# EAGLE design Transmitter Circuit v2.0 (EAGLE 4.16)
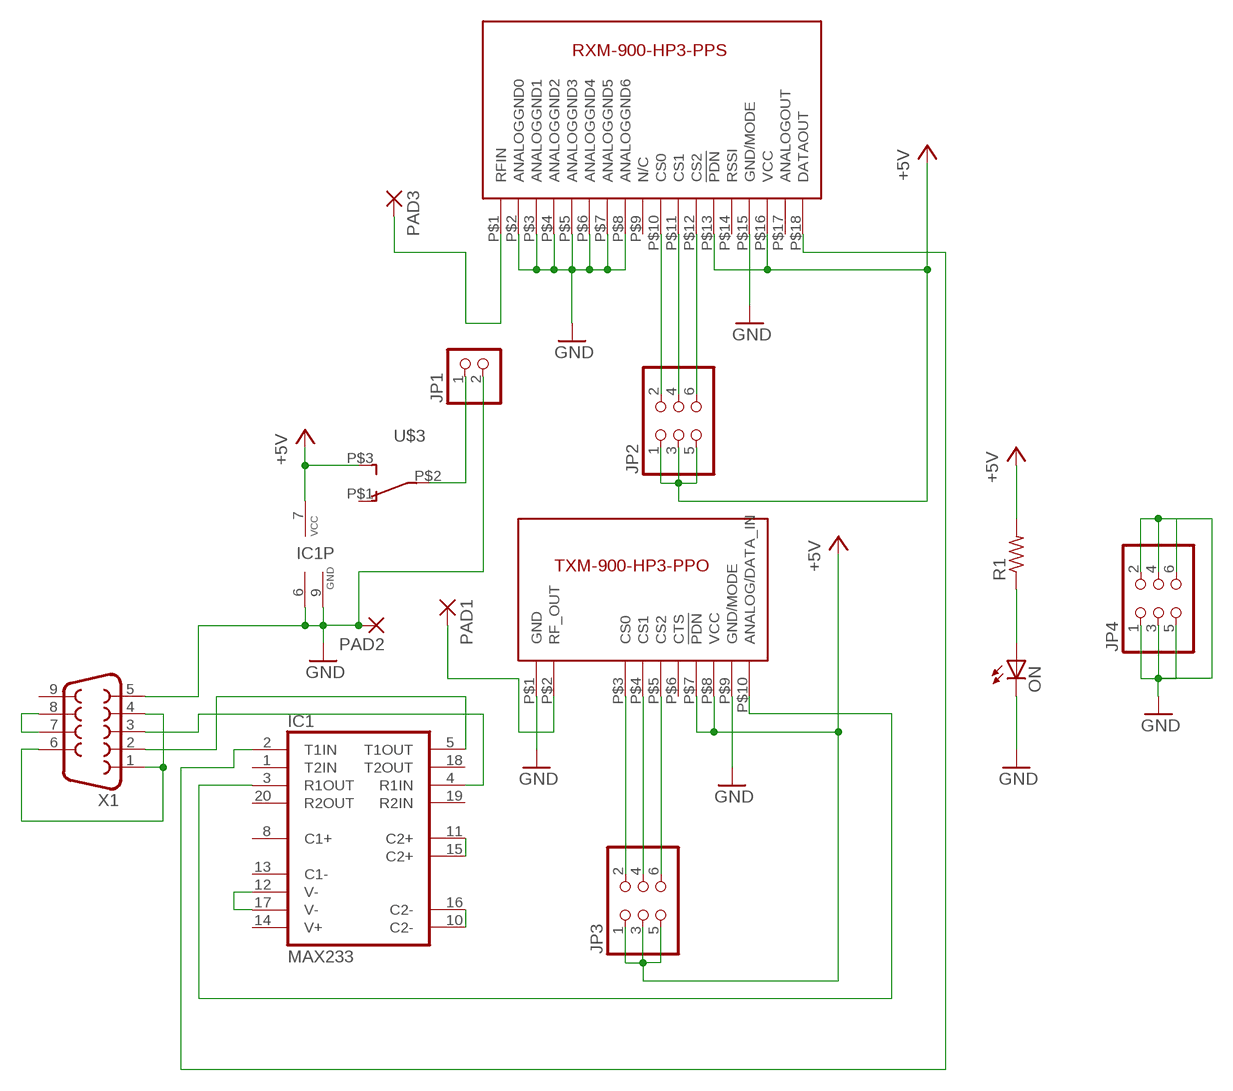
[diagram p0: schematic, sheet 1]

## Parts
IC1  MAX233  [DIL20]
JP1  PINHD-1X2  [1X02]
JP2  PINHD-2X3  [2X03]
JP3  PINHD-2X3  [2X03]
JP4  PINHD-2X3  [2X03]
ON  LED5MM  [LED5MM]
PAD1  2,54/0,8  [2,54/0,8]
PAD2  2,54/0,8  [2,54/0,8]
PAD3  2,54/0,8  [2,54/0,8]
R1  R-US_R1206  [R1206]
U$1  TXM-900-HP3-PPO  [SIP-10]
U$2  RX  [RX_UPRIGHT]
U$3  SLIDESWITCH  [SLIDESWITCH]
X1  F09D  [F09D]

## Nets
+5V [supply]: IC1.7(VCC) JP2.1 JP2.3 JP2.5 JP3.1 JP3.3 JP3.5 R1.2 U$1.P$7(!PDN) U$1.P$8(VCC) U$2.P$13(!PDN) U$2.P$16(VCC) U$3.P$3(S)
GND [supply]: IC1.6(GND) IC1.9(GND) JP1.2 JP4.1 JP4.2 JP4.3 JP4.4 JP4.5 JP4.6 ON.K(C) PAD2.1(P) U$1.P$1(GND) U$1.P$9(GND/MODE) U$2.P$2(ANALOGGND0) U$2.P$3(ANALOGGND1) U$2.P$4(ANALOGGND2) U$2.P$5(ANALOGGND3) U$2.P$6(ANALOGGND4) U$2.P$7(ANALOGGND5) U$2.P$8(ANALOGGND6) U$2.P$15(GND/MODE) X1.5
N$1: JP3.2 U$1.P$3(CS0)
N$2: JP3.4 U$1.P$4(CS1)
N$3: JP3.6 U$1.P$5(CS2)
N$4: IC1.4(R1IN) X1.3
N$5: X1.7 X1.8
N$6: IC1.12(V-) IC1.17(V-)
N$7: X1.1 X1.4 X1.6
N$8: IC1.10(C2-) IC1.16(C2-)
N$9: IC1.5(T1OUT) X1.2
N$10: IC1.11(C2+) IC1.15(C2+)
N$11: IC1.3(R1OUT) U$1.P$10(ANALOG/DATA_IN)
N$12: PAD1.1(P) U$1.P$2(RF_OUT)
N$13: ON.A R1.1
N$14: PAD3.1(P) U$2.P$1(RFIN)
N$15 [supply]: JP1.1 U$3.P$2(P)
N$16: JP2.2 U$2.P$10(CS0)
N$17: JP2.4 U$2.P$11(CS1)
N$18: JP2.6 U$2.P$12(CS2)
N$21: IC1.2(T1IN) U$2.P$18(DATAOUT)
Unconnected: IC1.1(T2IN) IC1.8(C1+) IC1.13(C1-) IC1.14(V+) IC1.18(T2OUT) IC1.19(R2IN) IC1.20(R2OUT) U$1.P$6(CTS) U$2.P$9(N/C) U$2.P$14(RSSI) U$2.P$17(ANALOGOUT) U$3.P$1(O) X1.9

## Library data of the parts
IC1 = maxim:MAX233: RS232 TRANSEIVER
JP1 = pinhead:PINHD-1X2: PIN HEADER
JP2-JP4 = pinhead:PINHD-2X3: PIN HEADER
ON = led:LED: LED OSRAM: - CHIPLED LG R971, LG N971, LY N971, LG Q971, LY Q971, LO R971, LY R971 LH N974, LH R974 LS Q976, LO Q976, LY Q976 LO Q996 - Hyper CHIPLED LW Q18S LB Q993, LB Q99A, LB R99A - SideLED LS A670, LO A670, LY A670, LG A670, LP A670 LB A673, LV A673, LT A673, LW A673 LH A674 LY A675 LS A676, LA A676, LO A676, LY A676, LW A676 LS A679, LY A679, LG A679 - Hyper Micro SIDELED® LS Y876, LA Y876, LO Y876, LY Y876 LT Y87S - SmartLED LW L88C, LW L88S LB L89C, LB L89S, LG L890 LS L89K, LO L89K, LY L89K LS L896, LA L896, LO L896, LY L896 - TOPLED LS T670, LO T670, LY T670, LG T670, LP T670 LSG T670, LSP T670, LSY T670, LOP T670, LYG T670 LG T671, LOG T671, LSG T671 LB T673, LV T673, LT T673, LW T673 LH T674 LS T676, LA T676, LO T676, LY T676, LB T676, LH T676, LSB T676, LW T676 LB T67C, LV T67C, LT T67C, LS T67K, LO T67K, LY T67K, LW E67C LS E67B, LA E67B, LO E67B, LY E67B, LB E67C, LV E67C, LT E67C LW T67C LS T679, LY T679, LG T679 LS T770, LO T770, LY T770, LG T770, LP T770 LB T773, LV T773, LT T773, LW T773 LH T774 LS E675, LA E675, LY E675, LS T675 LS T776, LA T776, LO T776, LY T776, LB T776 LHGB T686 LT T68C, LB T68C - Hyper Mini TOPLED® LB M676 - Mini TOPLED Santana® LG M470 LS M47K, LO M47K, LY M47K Source: http://www.osram.convergy.de/
PAD1-PAD3 = wirepad:2,54/0,8: THROUGH-HOLE PAD
R1 = rcl:R-US_: RESISTOR, American symbol
U$1 = linxtechnologies:TXM-900-HP3-PPO
U$2 = linxtechnologies:RX
U$3 = RFClib:SLIDESWITCH
X1 = con-subd:F09: SUB-D

## Net classes
1 supply: width 0.508 mm

## Board
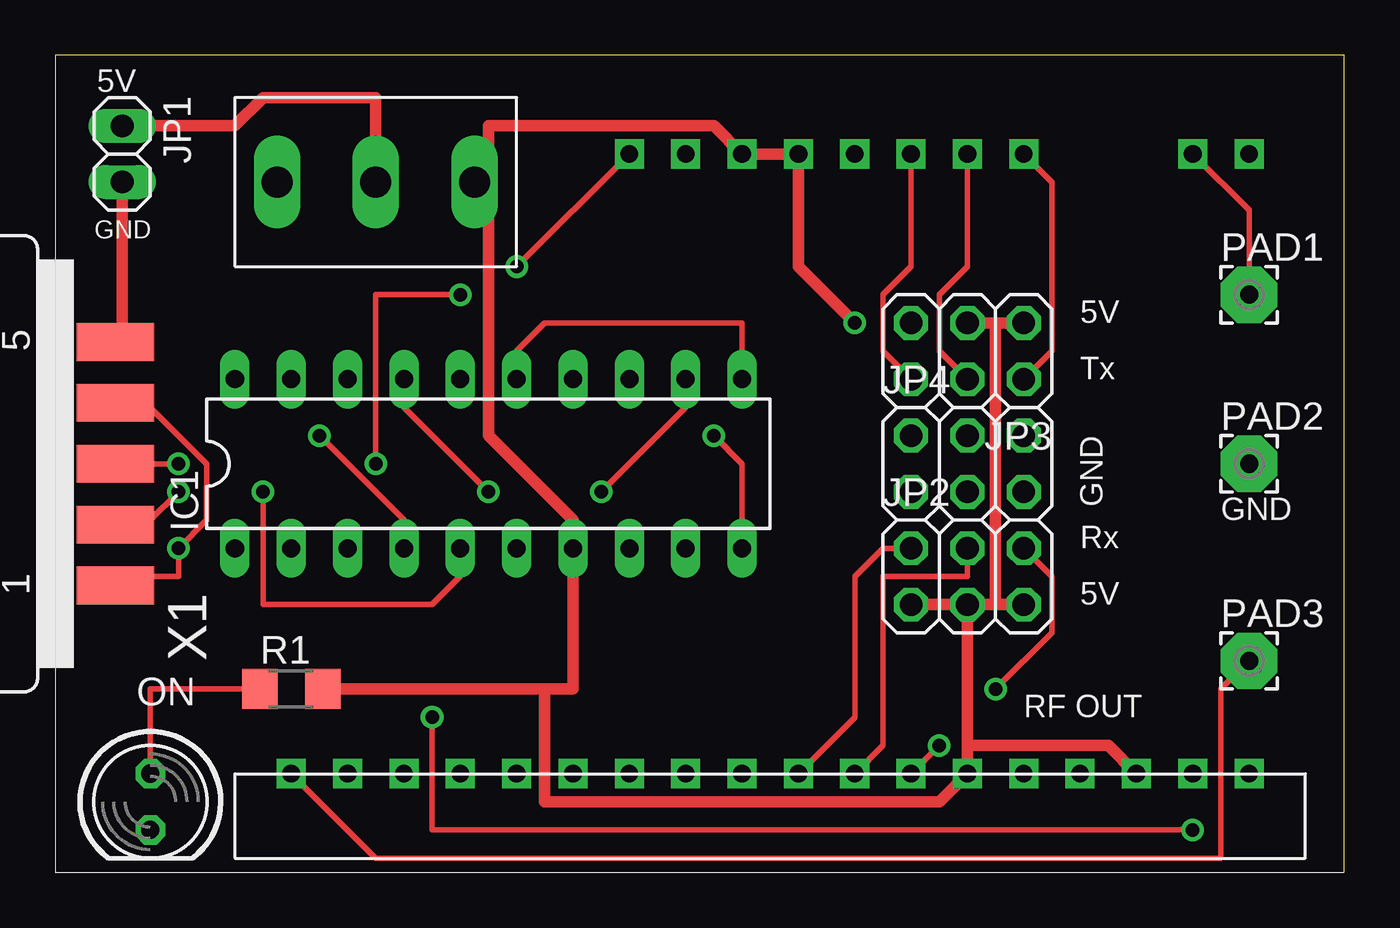
[diagram p1: board, top side]
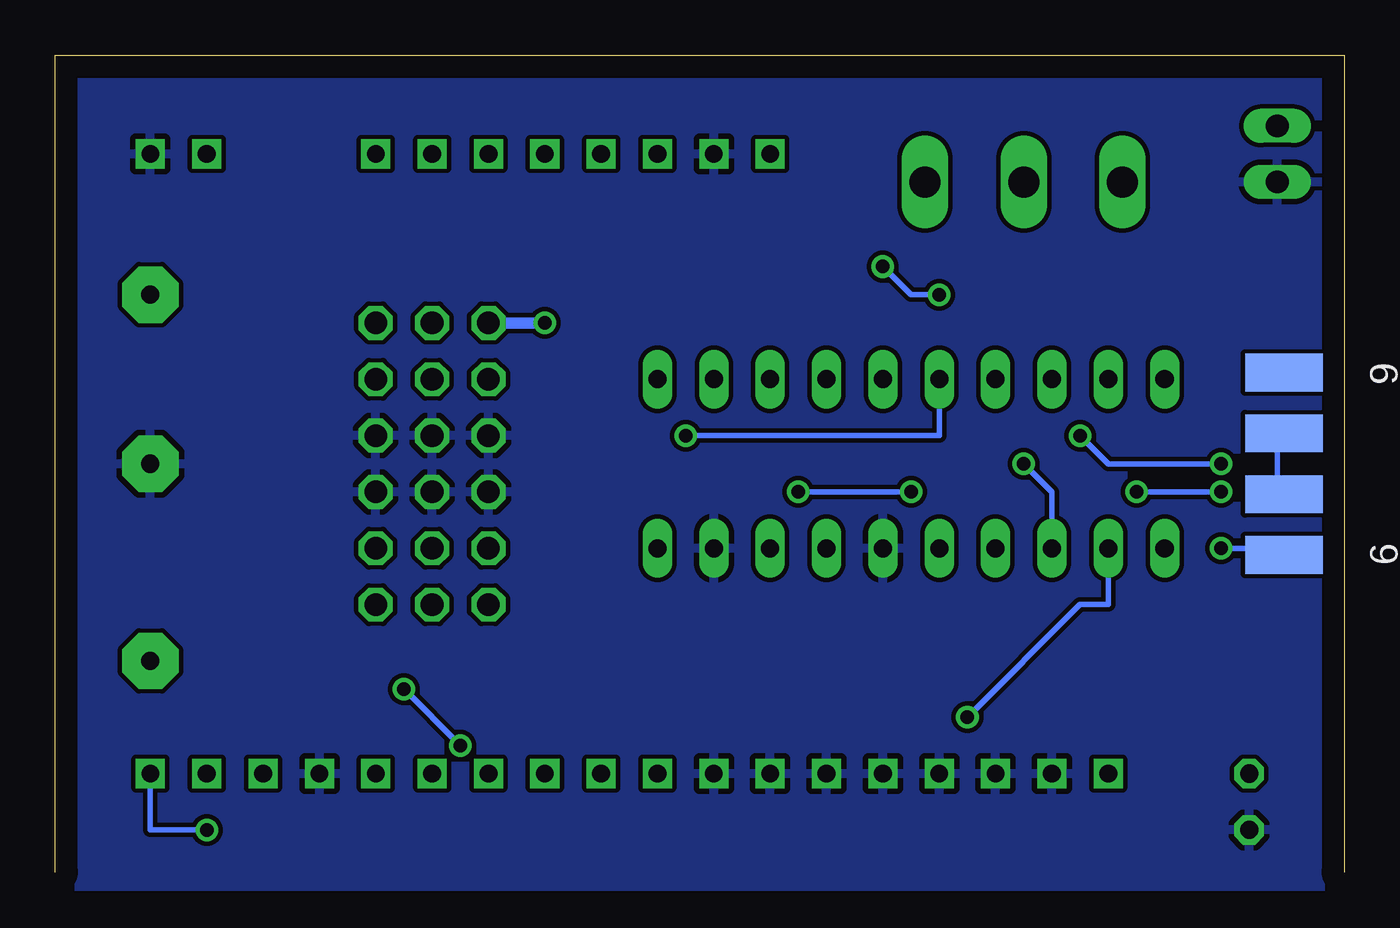
[diagram p2: board, bottom side, seen from below]

Size 58.09 x 36.82 mm. Coordinates in mm from the lower left corner, seen from the top.
Outline: 58.09,0 58.09,36.82 0,36.82 0,0
Copper layers (1*16): Top 0.035mm / dielectric 1.5mm / Bottom 0.035mm
Design rules "default": minimum track width 10mil, minimum drill 24mil, track to track 8mil, track to pad 8mil, pad to pad 8mil, via to via 8mil, smd to smd 8mil, copper to edge 40mil, drill to drill 8mil, minimum pad ring 10mil, minimum via ring 8mil, stop-mask expansion 4mil, vias tented up to drill 0mil, thermal gap 10mil

### Footprints (pad centres in the part's own frame; a part is rotated, then mirrored left to right if it is on the bottom)
DIL20 = drill 0.813 long: 1 -11.43,-3.81; 2 -8.89,-3.81; 3 -6.35,-3.81; 4 -3.81,-3.81; 5 -1.27,-3.81; 6 1.27,-3.81; 7 3.81,-3.81; 8 6.35,-3.81; 9 8.89,-3.81; 10 11.43,-3.81; 11 11.43,3.81; 12 8.89,3.81; 13 6.35,3.81; 14 3.81,3.81; 15 1.27,3.81; 16 -1.27,3.81; 17 -3.81,3.81; 18 -6.35,3.81; 19 -8.89,3.81; 20 -11.43,3.81
1X02 = drill 1.016 long: 1 -1.27,0; 2 1.27,0
2X03 = drill 1.016 octagon: 1 -2.54,-1.27; 2 -2.54,1.27; 3 0,-1.27; 4 0,1.27; 5 2.54,-1.27; 6 2.54,1.27
LED5MM = drill 0.813 octagon: A -1.27,0; K 1.27,0
2,54/0,8 = drill 0.813 pad 2.54 octagon: 1 0,0
R1206 = smd 1.6 x 1.803: 1 -1.422,0; 2 1.422,0
SIP-10 = drill 0.8 square: P$1 0,0; P$2 2.54,0; P$3 10.16,0; P$4 12.7,0; P$5 15.24,0; P$6 17.78,0; P$7 20.32,0; P$8 22.86,0; P$9 25.4,0; P$10 27.94,0
RX_UPRIGHT = drill 0.8 square: P$1 2.54,0; P$2 5.08,0; P$3 7.62,0; P$4 10.16,0; P$5 12.7,0; P$6 15.24,0; P$7 17.78,0; P$8 20.32,0; P$9 22.86,0; P$10 25.4,0; P$11 27.94,0; P$12 30.48,0; P$13 33.02,0; P$14 35.56,0; P$15 38.1,0; P$16 40.64,0; P$17 43.18,0; P$18 45.72,0
SLIDESWITCH = drill 1.4 long: P$1 3.81,10.795; P$2 3.81,6.35; P$3 3.81,1.905
F09D = smd 1.7 x 3.5: 1 -5.486,-6.045; 2 -2.743,-6.045; 3 0,-6.045; 4 2.743,-6.045; 5 5.486,-6.045 | smd 1.7 x 3.5 bottom: 6 -4.115,-6.045; 7 -1.372,-6.045; 8 1.372,-6.045; 9 4.115,-6.045

### Placement (x,y rotation side)
IC1  19.52,18.41 0 top
JP1  3.01,32.38 270 top
JP2  41.11,13.33 0 top
JP3  41.11,23.49 180 top
JP4  41.11,18.41 0 top
ON  4.28,3.17 270 top
PAD1  53.81,26.03 0 top
PAD2  53.81,18.41 0 top
PAD3  53.81,9.52 0 top
R1  10.63,8.25 0 top
U$1  53.81,32.38 180 top
U$2  8.09,4.44 0 top
U$3  20.79,27.3 90 top
X1  -3.34,18.41 90 top

### Tracks (layer width: path | path; a pad name or v marks a point on that pad's centre or on a via)
+5V  (via drill 0.61)
  Top 0.508: 42.38,24.76 JP3.1 | 42.38,24.76 JP3.3 | 41.11,5.71 JP2.3 | 41.11,5.71 U$2.P$13 39.84,3.17 22.06,3.17 22.06,8.25 | U$2.P$16 47.46,5.71 41.11,5.71 | JP2.3 JP2.1 | JP2.3 42.38,12.06 | 42.38,12.06 JP2.5 | 42.38,12.06 42.38,24.76 | v36.03,24.76 33.49,27.3 U$1.P$7 U$1.P$8 29.68,33.65 19.52,33.65 19.52,32.38 U$3.P$3 19.52,29.84 19.52,19.68 23.33,15.87 IC1.7 23.33,8.25 22.06,8.25 | 22.06,8.25 R1.2 11.9,8.25
  Bottom 0.508: v36.03,24.76 JP3.5
GND
  Top 0.508: JP1.2 3.01,23.49 X1.5
  pour Bottom: -0.8,-0.64 -0.8,37.46 58.89,37.46 58.89,-0.64
N$1
  Top 0.254: U$1.P$3 44.92,31.11 44.92,23.49 JP3.2
N$2
  Top 0.254: U$1.P$4 41.11,27.3 39.84,26.03 39.84,23.49 JP3.4
N$3
  Top 0.254: U$1.P$5 38.57,27.3 37.3,26.03 37.3,23.49 JP3.6
N$4  (via drill 0.61)
  Top 0.254: v11.9,19.68 15.71,15.87 IC1.4 | X1.3 v5.55,18.41
  Bottom 0.254: v11.9,19.68 10.63,18.41 v5.55,18.41
N$5
  Bottom 0.254: X1.7 3.01,17.14 3.01,19.68 X1.8
N$6  (via drill 0.61)
  Top 0.254: v19.52,17.14 15.71,20.95 IC1.17 | v24.6,17.14 28.41,20.95 IC1.12
  Bottom 0.254: v19.52,17.14 v24.6,17.14
N$7  (via drill 0.61)
  Top 0.254: X1.1 4.28,13.33 5.55,13.33 v5.55,14.6 6.82,15.87 6.82,18.41 4.28,20.95 X1.4
  Bottom 0.254: v5.55,14.6 4.28,14.6 X1.6
N$8  (via drill 0.61)
  Top 0.254: v29.68,19.68 30.95,18.41 IC1.10
  Bottom 0.254: v29.68,19.68 18.25,19.68 IC1.16
N$9  (via drill 0.61)
  Top 0.254: v9.36,17.14 9.36,12.06 16.98,12.06 18.25,13.33 IC1.5 | v5.55,17.14 4.28,15.87 X1.2
  Bottom 0.254: v5.55,17.14 v9.36,17.14
N$10
  Top 0.254: IC1.15 20.79,23.49 22.06,24.76 30.95,24.76 IC1.11
N$11  (via drill 0.61)
  Top 0.254: v20.79,27.3 U$1.P$10 | v18.25,26.03 14.44,26.03 v14.44,18.41
  Bottom 0.254: v20.79,27.3 19.52,26.03 v18.25,26.03 | v14.44,18.41 13.17,17.14 IC1.3
N$12
  Top 0.254: U$1.P$2 53.81,29.84 PAD1.1
N$13
  Top 0.254: ON.A 4.28,8.25 R1.1 9.36,8.25
N$14
  Top 0.254: U$2.P$1 14.44,0.63 52.54,0.63 52.54,8.25 PAD3.1
N$15
  Top 0.508: JP1.1 8.09,33.65 9.36,34.92 14.44,34.92 U$3.P$2
N$16
  Top 0.254: U$2.P$10 36.03,6.98 36.03,13.33 37.3,14.6 JP2.2
N$17
  Top 0.254: U$2.P$11 37.3,5.71 37.3,13.33 41.11,13.33 JP2.4
N$18  (via drill 0.61)
  Top 0.254: U$2.P$12 v39.84,5.71 | v42.38,8.25 44.92,10.79 44.92,13.33 JP2.6
  Bottom 0.254: v39.84,5.71 v42.38,8.25
N$21  (via drill 0.61)
  Top 0.254: v51.27,1.9 16.98,1.9 v16.98,6.98
  Bottom 0.254: U$2.P$18 53.81,1.9 v51.27,1.9 | v16.98,6.98 11.9,12.06 10.63,12.06 IC1.2

### Text on the board
tPlace: 5V | Tx | GND | Rx | 5V
tNames: 5V | GND | GND | RF OUT